# Altium schematic sheet connector.SchDoc
size A3; SheetNumber: 1; SheetTotal: 1
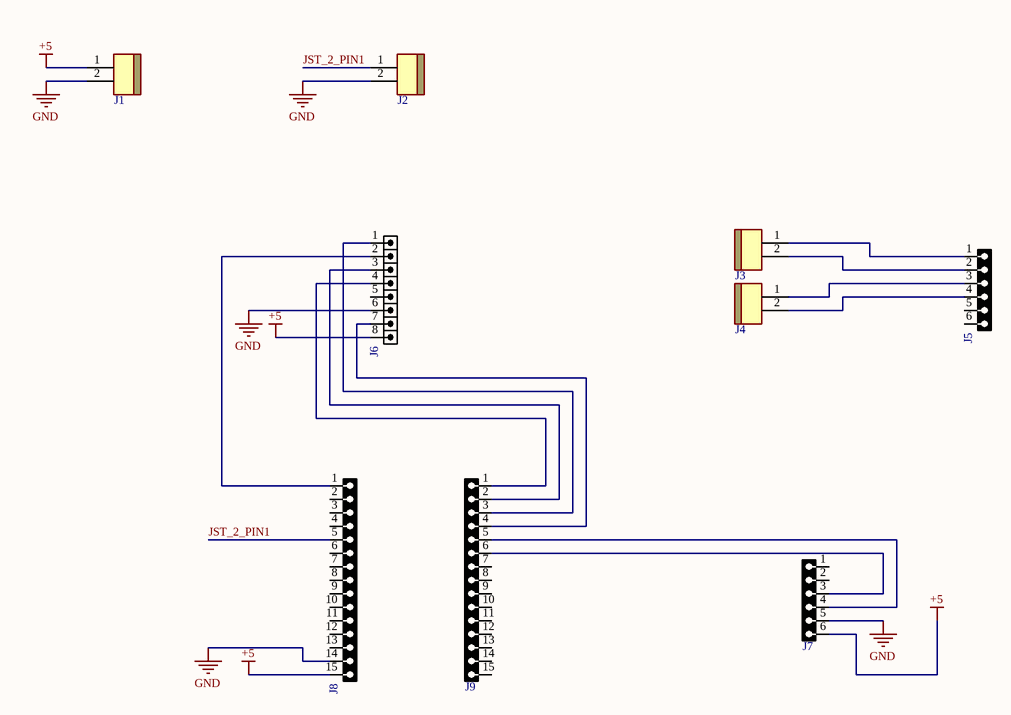
[diagram p0: connector.SchDoc]

## Parts
J1  JST BxB-PH-K 2Pin  [JST B2B-PH-K]  (value not drawn)
J2  JST BxB-PH-K 2Pin  [JST B2B-PH-K]  (value not drawn)
J3  JST BxB-PH-K 2Pin  [JST B2B-PH-K]  (value not drawn)
J4  JST BxB-PH-K 2Pin  [JST B2B-PH-K]  (value not drawn)
J5  HDRF6  [HDRLP_F_1X6]  (value not drawn)
J6  HDRM8  [HDRLP_M_1X8]  (value not drawn)
J7  HDRF6  [HDRLP_F_1X6]  (value not drawn)
J8  HDRF15  [HDR_F_1X15]  (value not drawn)
J9  HDRF15  [HDR_F_1X15]  (value not drawn)

## Nets
+5: J1.1 J6.8 J7.6 J8.15
GND: J1.2 J2.2 J6.6 J7.5 J8.14
JST_2_PIN1: J2.1 J8.5
NetJ3_1: J3.1 J5.1
NetJ3_2: J3.2 J5.2
NetJ4_1: J4.1 J5.3
NetJ4_2: J4.2 J5.4
NetJ6_1: J6.1 J9.3
NetJ6_2: J6.2 J8.1
NetJ6_3: J6.3 J9.2
NetJ6_4: J6.4 J9.1
NetJ6_7: J6.7 J9.4
NetJ7_3: J7.3 J9.6
NetJ7_4: J7.4 J9.5

Not connected (* = marked no-connect by the designer): J5 5 6; J6 5; J7 1 2; J8 2 3 4 6 7 8 9 10 11 12 13; J9 7 8 9 10 11 12 13 14 15

## Library data of the parts
J1-J4 = JST BxB-PH-K 2Pin: Connector Header Through Hole 0.079" (2.00mm); PartNumber: B2B-PH-K-S(LF)(SN)
J5 J7 = HDRLP_F_1X6: CONN, HEADER, Male, pitch: 2.54mm, 6POS; VALUE: HDRF6
J6 = HDRLP_M_1X8: CONN, HEADER, Male, pitch: 2.54mm, 8POS; VALUE: HDRM8
J8 J9 = HDR_F_1X15: CONN, HEADER, Female, pitch: 2.54mm, 15POS; VALUE: HDRF15